# Altium project pulseox-main-PCB.PrjPcb
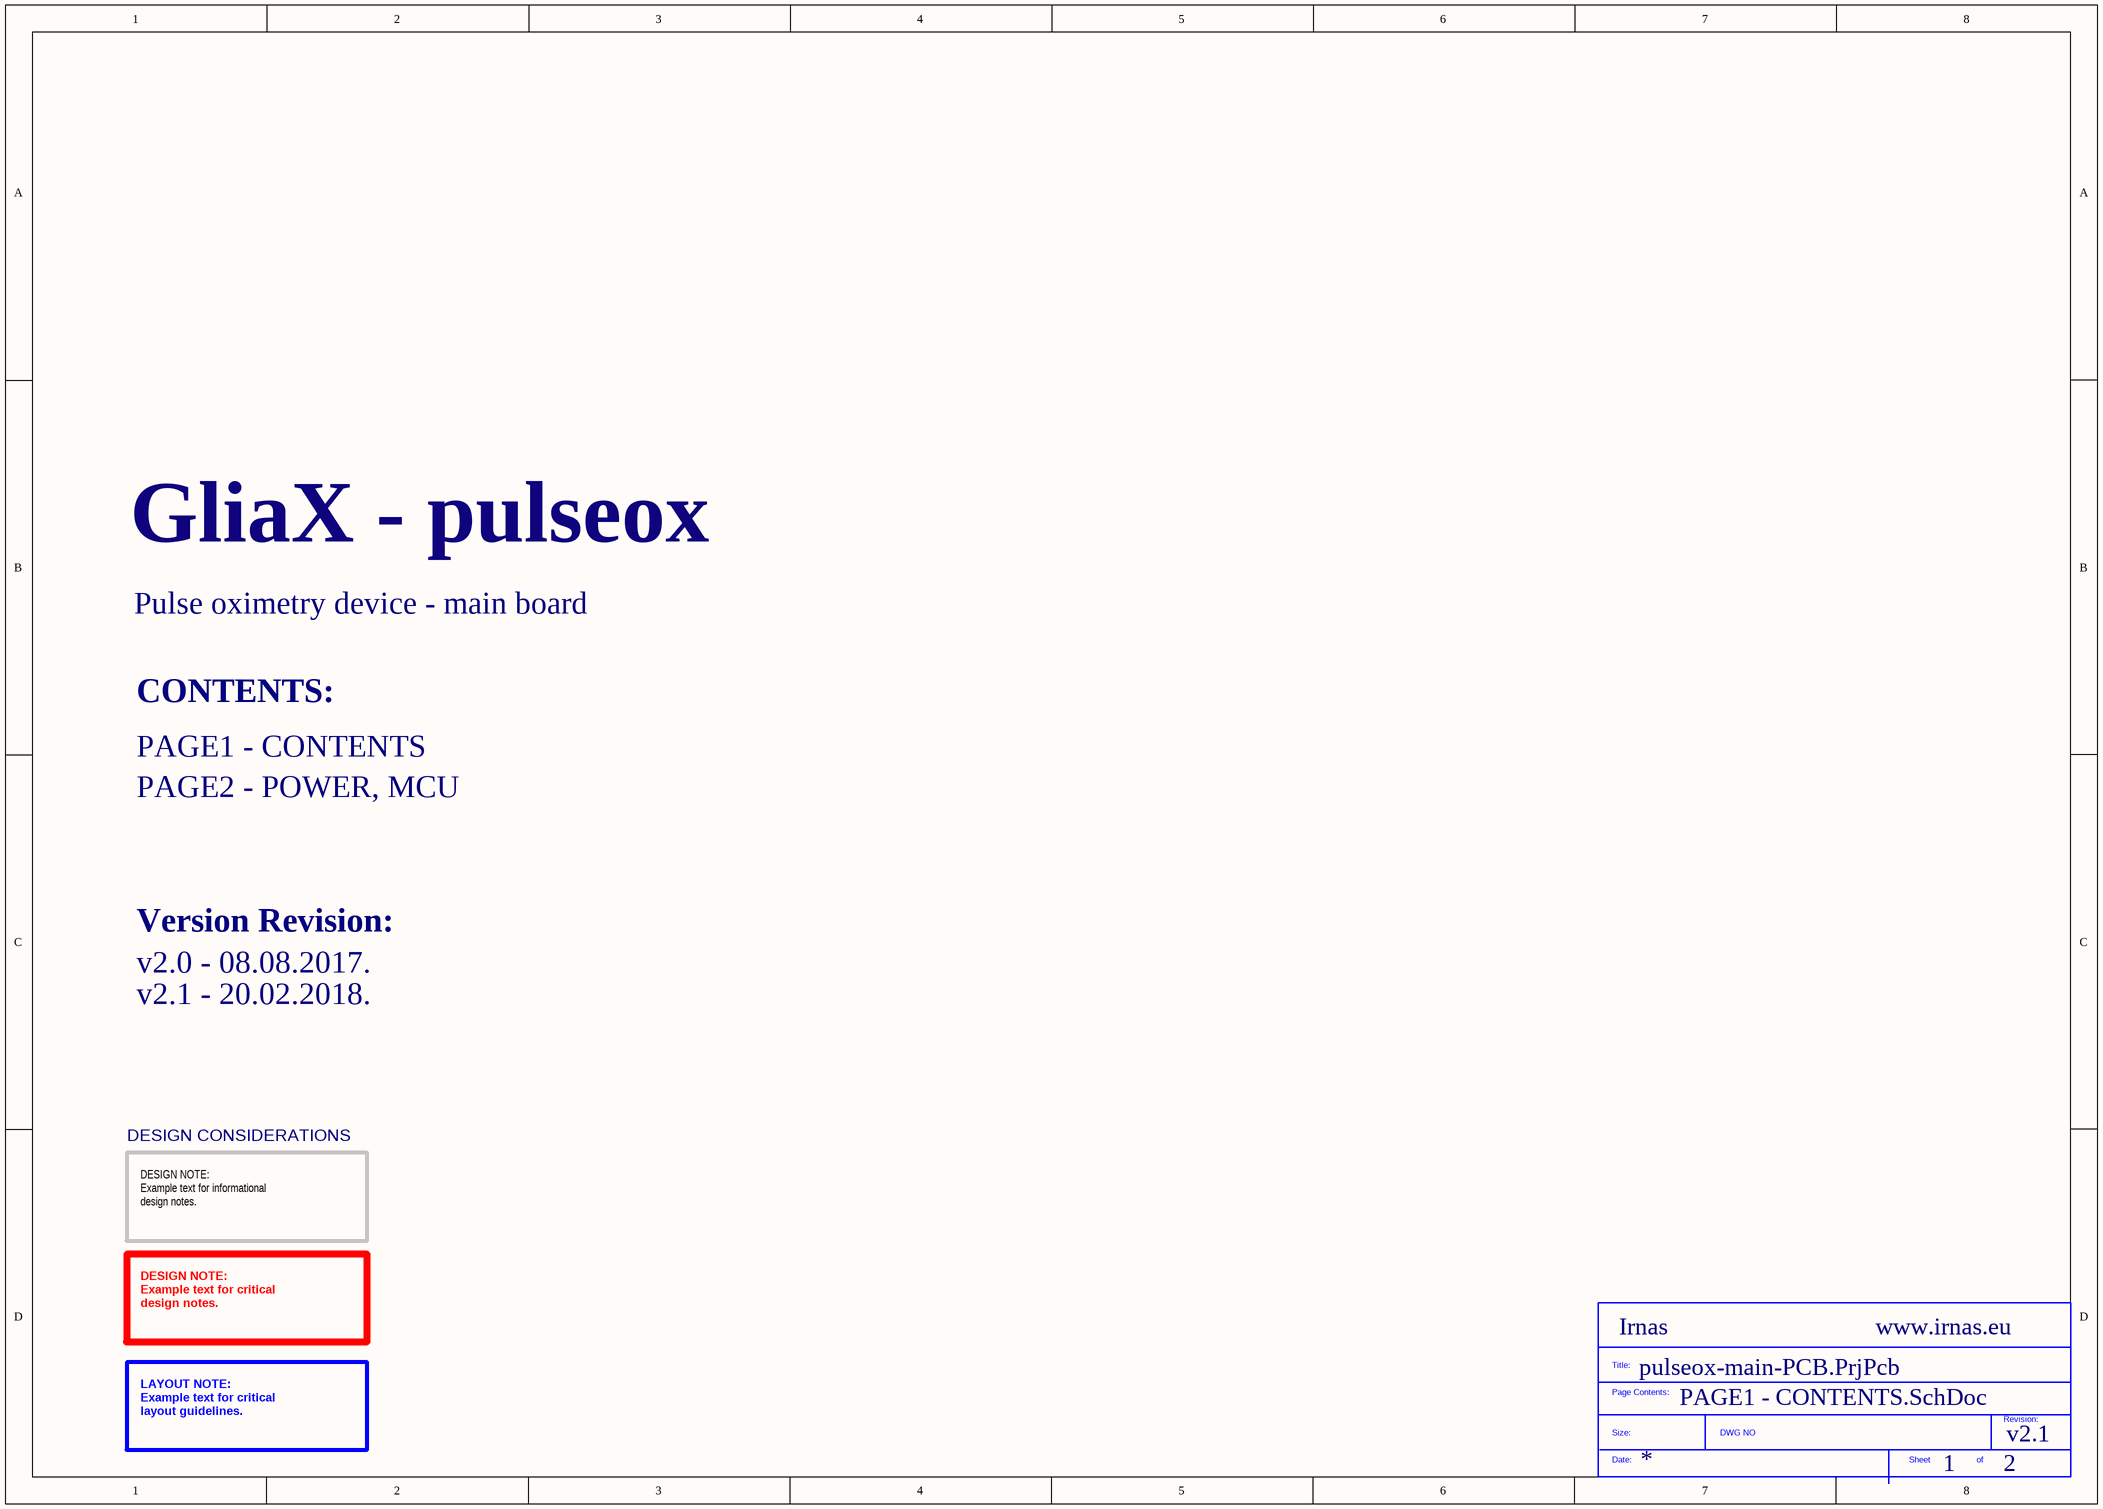
[diagram p0: PAGE1 - CONTENTS.SchDoc]
Company: Irnas; ProjectTitle: GliaX - pulseox; Version: v2.1; Website: www.irnas.eu
2 sheets, 32 parts. Net scope: global (net labels, ports and power ports of the same name join across sheets).
Board file: pulseox-main-PCB.PcbDoc
Sheets:
  PAGE1 - CONTENTS.SchDoc
  PAGE2 - POWER, MCU.SchDoc

## Sheet PAGE1 - CONTENTS.SchDoc
size A3; DocumentNumber: 1; SheetNumber: 1; SheetTotal: 2

### Parts
(Parts that share a designator on the sheet are numbered #1, #2 ... from top to bottom, then left to right.)
*?#1  SDTitleBlock  (value not drawn)  (graphical)

### Notes on the sheet
- Pulse oximetry device - main board
- CONTENTS:
- PAGE1 - CONTENTS
- PAGE2 - POWER, MCU
- Version Revision:
- v2.0 - 08.08.2017.
- v2.1 - 20.02.2018.
- DESIGN CONSIDERATIONS
- DESIGN NOTE:
  Example text for informational
  design notes.
- DESIGN NOTE:
  Example text for critical
  design notes.
- LAYOUT NOTE:
  Example text for critical
  layout guidelines.
- (in symbol SDTitleBlock) Title:; Page Contents:; Revision:; Size:; DWG NO; Date:; Sheet; of

## Sheet PAGE2 - POWER, MCU.SchDoc
size A3
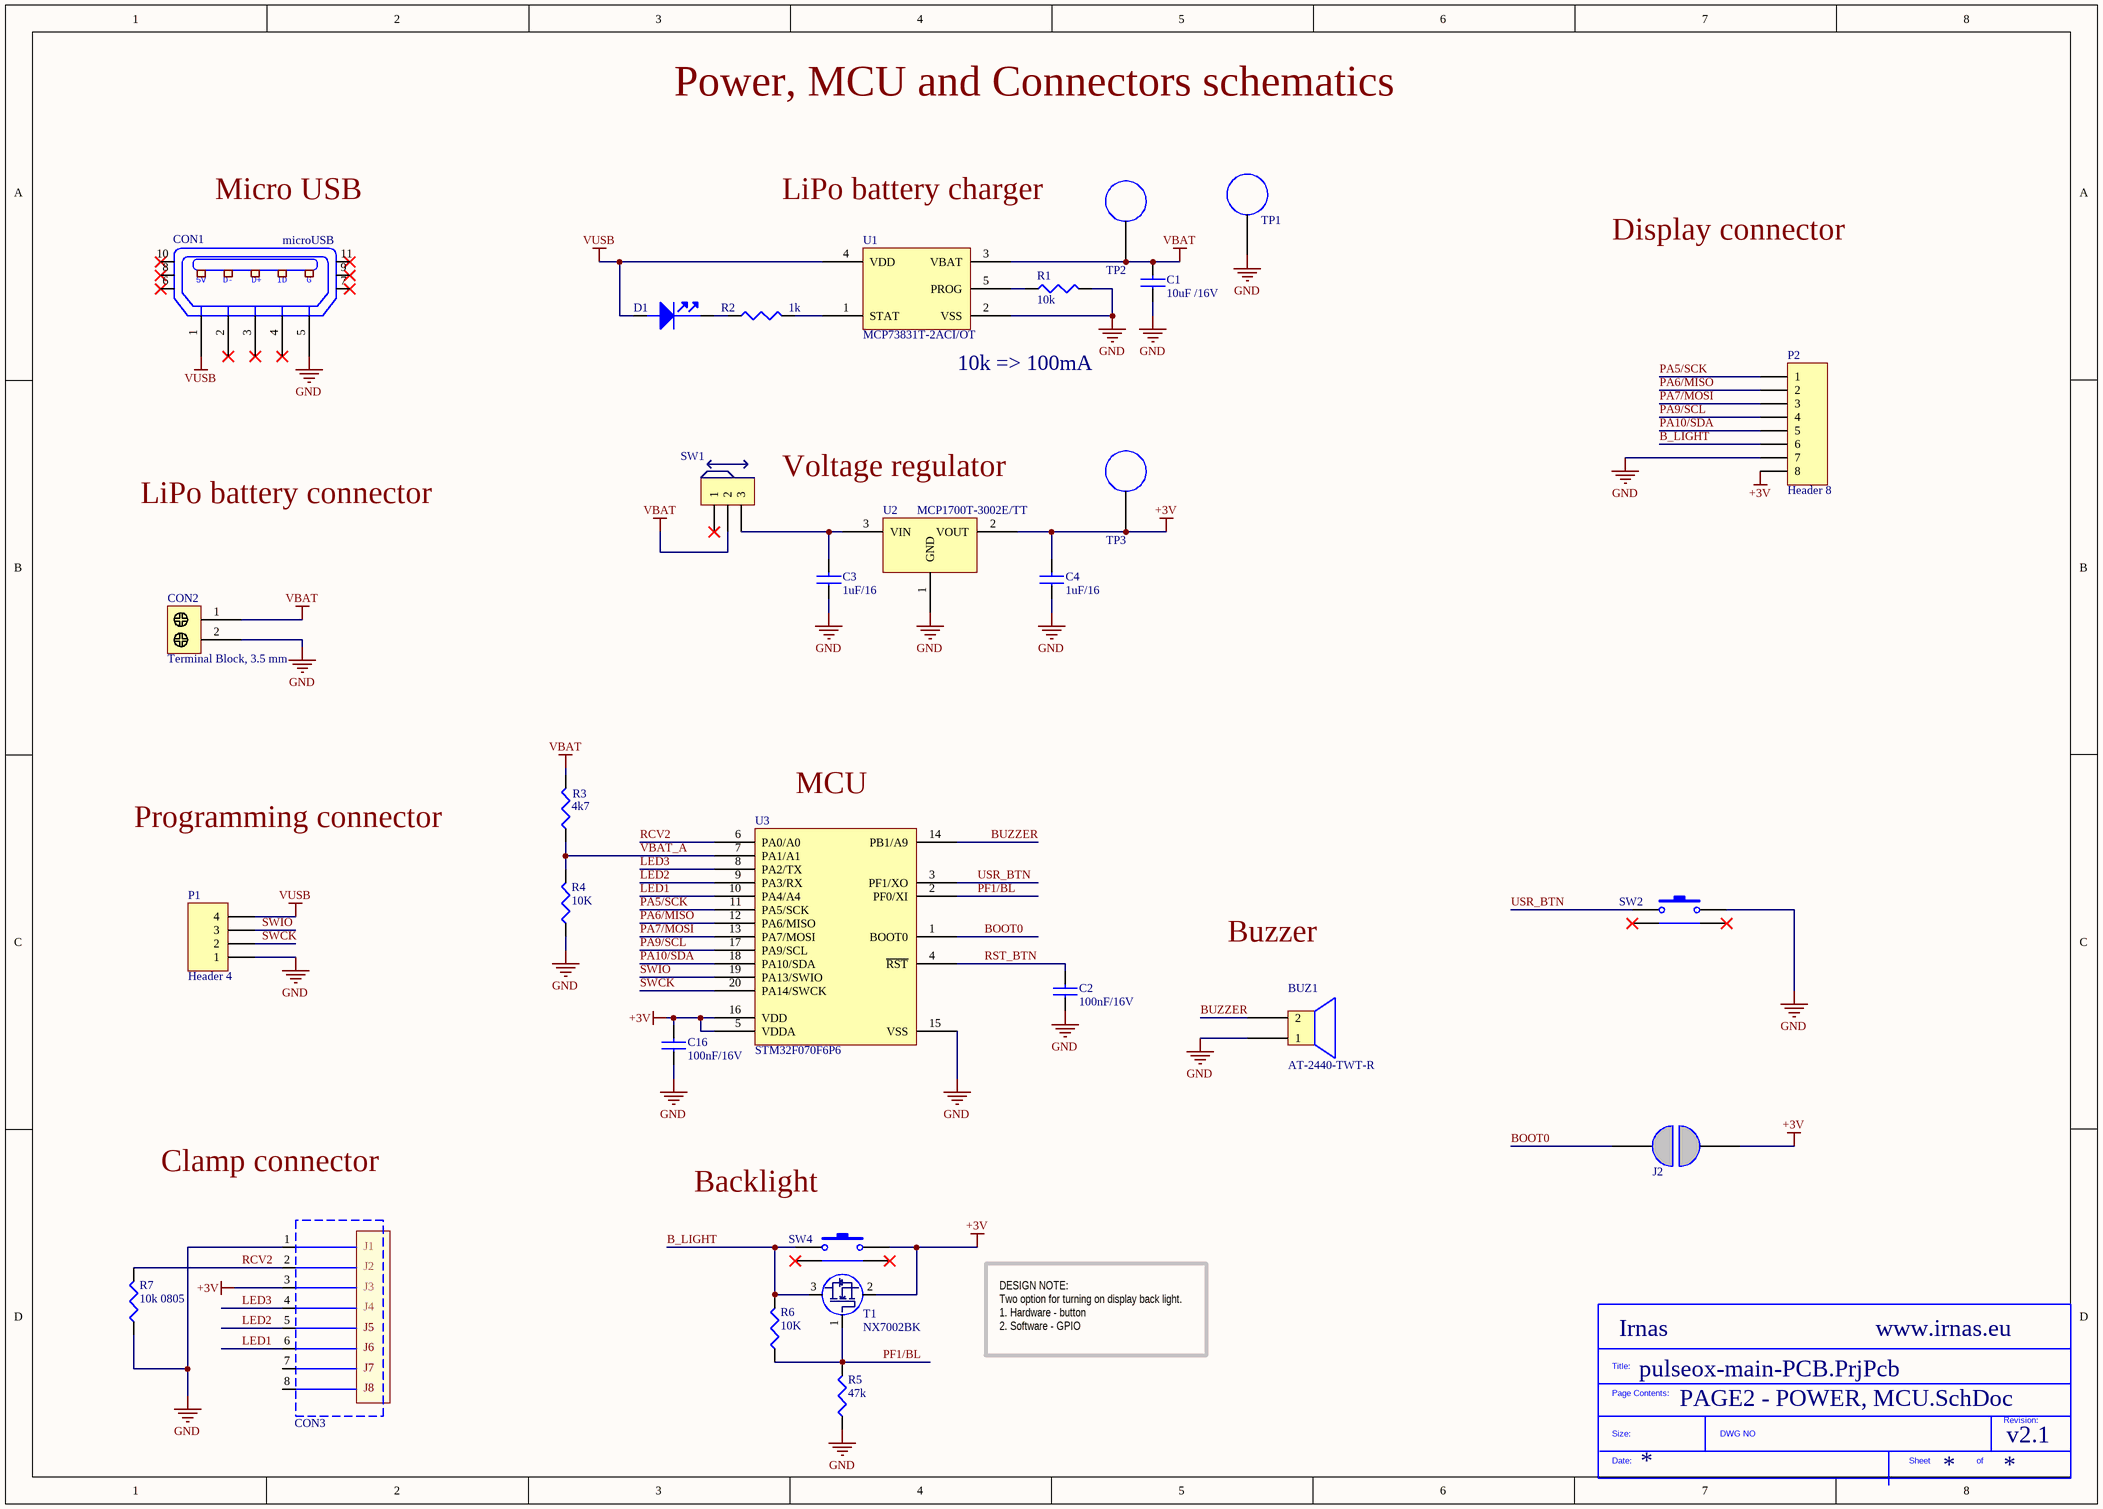
[diagram p1: PAGE2 - POWER, MCU.SchDoc]

### Parts
(Parts that share a designator on the sheet are numbered #1, #2 ... from top to bottom, then left to right.)
*?#2  SDTitleBlock  (value not drawn)  (graphical)
BUZ1  AT-2440-TWT-R  [Buzzer]
C1  10uF /16V  [CAP0805]
C2  100nF/16V  [CAP0805]
C3  1uF/16  [CAP0805]
C4  1uF/16  [CAP0805]
C16  100nF/16V  [CAP0805]
CON1  microUSB  [microUSB-CHINA]
CON2  Terminal Block, 3.5 mm  [Block Terminal 3.5mm]
CON3  PS000036  [eth con]  (value not drawn)
D1  LED RED  [LED0603]  (value not drawn)
J2  Solder jumper  [solder jumper smd]  (value not drawn)  (no BOM)
P1  Header 4  [HDR1X4]
P2  Header 8  [HDR1X8]
R1  10k  [RES0603]
R2  1k  [RES0603]
R3  4k7  [RES0805]
R4  10K  [RES0805]
R5  47k  [RES0805]
R6  10K  [RES0805]
R7  10k 0805  [RES0805]
SW1  SLIDE SW  [SLIDE_SW]  (value not drawn)
SW2  PTS645VH58-2LFS  [SW TH ANGLE_2]  (value not drawn)
SW4  FSMRA4JH04  [SW TH ANGLE_1]  (value not drawn)
T1  NX7002BK  [SOT23]
TP1  TP  [TP]  (value not drawn)  (no BOM)
TP2  TP  [TP]  (value not drawn)  (no BOM)
TP3  TP  [TP]  (value not drawn)  (no BOM)
U1  MCP73831T-2ACI/OT  [SOT23127P600-8N]
U2  MCP1700T-3002E/TT  [SOT23127P600-8N - duplicate]
U3  STM32F070F6P6  [SOP127P600-8N]

### Nets
+3V: C4.2 C16.2 CON3.3 J2.2 P2.8 SW4.2 T1.2(S) TP3.1 U2.2(VOUT) U3.5(VDDA) U3.16(VDD)
GND: BUZ1.1 C1.1 C2.1 C3.1 C4.1 C16.1 CON1.5(P5) CON2.2 CON3.1 P1.1 P2.7 R1.2 R4.1 R5.1 R7.1 SW2.2 TP1.1 U1.2(VSS) U2.1(GND) U3.15(VSS)
VBAT: C1.2 CON2.1 R3.2 SW1.2 TP2.1 U1.3(VBAT)
VUSB: CON1.1(P1) D1.2(ANODE) P1.4 U1.4(VDD)
B_LIGHT: P2.6 R6.2 SW4.1 T1.3(D)
BOOT0: J2.1 U3.1(BOOT0)
BUZZER: BUZ1.2 U3.14(PB1/A9)
LED1: CON3.6 U3.10(PA4/A4)
LED2: CON3.5 U3.9(PA3/RX)
LED3: CON3.4 U3.8(PA2/TX)
PA5/SCK: P2.1 U3.11(PA5/SCK)
PA6/MISO: P2.2 U3.12(PA6/MISO)
PA7/MOSI: P2.3 U3.13(PA7/MOSI)
PA9/SCL: P2.4 U3.17(PA9/SCL)
PA10/SDA: P2.5 U3.18(PA10/SDA)
PF1/BL: R5.2 R6.1 T1.1(G) U3.2(PF0/XI)
RCV2: CON3.2 R7.2 U3.6(PA0/A0)
RST_BTN: C2.2 U3.4(~{RST})
SWCK: P1.2 U3.20(PA14/SWCK)
SWIO: P1.3 U3.19(PA13/SWIO)
USR_BTN: SW2.1 U3.3(PF1/XO)
VBAT_A: R3.1 R4.2 U3.7(PA1/A1)
NetC3_2: C3.2 SW1.3 U2.3(VIN)
NetD1_1: D1.1(cathode) R2.1
NetR1_1: R1.1 U1.5(PROG)
NetR2_2: R2.2 U1.1(STAT)

Not connected (* = marked no-connect by the designer): CON1 2(P2)* 3(P3)* 4(P4)* 6* 7* 8* 9* 10* 11*; CON3 7 8; SW1 1*; SW2 3* 4*; SW4 3* 4*

### Notes on the sheet
- Power, MCU and Connectors schematics
- Micro USB
- (near TP2) LiPo battery charger
- Display connector
- (near U1) 10k => 100mA
- LiPo battery connector
- Voltage regulator
- Programming connector
- (near U3) MCU
- Buzzer
- Clamp connector
- (near SW4) Backlight
- DESIGN NOTE:
  Two option for turning on display back light.
  1. Hardware - button
  2. Software - GPIO
- (in symbol Micro USB CHINA 1) 5V; D-; D+; ID; G
- (in symbol PS000036) J1; J2; J3; J4; J5; J6; J7; J8
- (in symbol SDTitleBlock) Title:; Page Contents:; Revision:; Size:; DWG NO; Date:; Sheet; of

### Library data of the parts
BUZ1 = AT-2440-TWT-R: AUDIO PIEZO TRANSDUCER 1-30V TH; Manufacturer: PUI Audio, Inc.; Driver Circuitry: Transducer, Externally Driven; Input Type: Peak-Peak Signal; Voltage - Rated: 3V; Voltage Range: 1 ~ 30V; Frequency: 4kHz; Operating Mode: Single Tone; Sound Pressure Level (SPL): 80dB @ 3V, 10cm; Current - Supply: 1mA; Port Location: Top; Ratings: Washable; Supplier 1: Digi-Key; Manufacturer Part Number: AT-2440-TWT-R; RoHS: RoHS Compliant; Category: Audio Products; Stock 1: 3028; Pricing 1: 1=1.87, 10=1.7, 100=1.36, 500=1.1288, 1000=0.986, 5000=0.884 (USD); Packaging: Tray; Part Status: Active; Technology: Piezo; Duration: -; Operating Temperature: -20°C ~ 60°C; Approvals: -; Mounting Type: Through Hole; Termination: PC Pins; Size / Dimension: 0.945" Dia (24.00mm); Height - Seated (Max): 0.303" (7.70mm); ComponentLink1URL: http://www.puiaudio.com/pdf/AT-2440-TWT-R.pdf; ComponentLink1Description: http://www.puiaudio.com/pdf/AT-2440-TWT-R.pdf; Supplier Part Number 1: 668-1103-ND
C1 = 10uF /16V: TDK - CGA4J1X5R1C106K125AC - CAP, MLCC, X5R, 10UF, 16V, 0805; Supplier 1: Farnell; Manufacturer: TDK; Manufacturer Part Number: CGA4J1X5R1C106K125AC; RoHS: YES; Stock 1: 8974; Pricing 1: 5=0.41, 50=0.146, 250=0.131, 500=0.12, 1000=0.103 (GBP); ComponentLink1URL: http://bcove.me/e1v54mtm; ComponentLink1Description: http://bcove.me/e1v54mtm; ComponentLink2URL: http://www.farnell.com/datasheets/1936565.pdf; ComponentLink2Description: http://www.farnell.com/datasheets/1936565.pdf; ComponentLink3URL: http://www.farnell.com/datasheets/1683658.pdf; ComponentLink3Description: http://www.farnell.com/datasheets/1683658.pdf; Supplier Part Number 1: 2210948RL
C2 C16 = 100nF 16V 0805: MURATA - GRM219R71C104KA01D - CAP, MLCC, X7R, 0.1UF, 16V, 0805; Ceramic Capacitor Case: 0805 [2012 Metric]; Capacitance: 0.1; Voltage Rating: 16; Capacitance Tolerance: ± 10%; Dielectric Characteristic: X7; Product Range: GRM Series; SVHC: No SVHC (17-Dec-2015; Supplier 1: Farnell; Manufacturer: MURATA; Manufacturer Part Number: GRM219R71C104KA01D; RoHS: YES; Stock 1: 4286; Pricing 1: 10=0.0517, 100=0.0335, 500=0.0221, 1000=0.02, 2000=0.0175, 4000=0.0134, 20000=0.0095, 40000=0.0081 (GBP); Packaging: Cut Tape; Operating Temperature Min: -55; Operating Temperature Max: 125; Automotive Qualification Standard: -; MSL: MSL 1 - Unlimited; ComponentLink1URL: http://www.farnell.com/datasheets/2079178.pdf; ComponentLink1Description: http://www.farnell.com/datasheets/2079178.pdf; ComponentLink2URL: http://www.farnell.com/datasheets/1935878.pdf; ComponentLink2Description: http://www.farnell.com/datasheets/1935878.pdf; Supplier Part Number 1: 2611934
C3 C4 = 1uF 16V 0805: MURATA - GRM21BR71C105KA01K - CAP, MLCC, X7R, 1UF, 16V, 0805; Ceramic Capacitor Case: 0805 [2012 Metric]; Capacitance: 1; Voltage Rating: 16; Capacitance Tolerance: ± 10%; Dielectric Characteristic: X7; Product Range: GRM Series; SVHC: No SVHC (20-Jun-2016; Supplier 1: Farnell; Manufacturer: MURATA; Manufacturer Part Number: GRM21BR71C105KA01K; RoHS: YES; Stock 1: 18829; Pricing 1: 10=0.0623, 100=0.0388, 500=0.0279, 2500=0.0221, 5000=0.0195, 10000=0.0162, 50000=0.0139, 100000=0.0126 (GBP); Packaging: Cut Tape; Operating Temperature Min: -55; Operating Temperature Max: 125; Automotive Qualification Standard: -; MSL: MSL 1 - Unlimited; ComponentLink1URL: http://www.farnell.com/datasheets/2189141.pdf; ComponentLink1Description: http://www.farnell.com/datasheets/2189141.pdf; Supplier Part Number 1: 2688536
CON1 = Micro USB CHINA 1
CON2 = 1776275-2: TE CONNECTIVITY - 1776275-2 - TERMINAL BLOCK, WIRE TO BRD, 2POS, 18AWG; Pitch Spacing: 3.5; No. of Positions: 2; Wire Size AWG Min: 26; Wire Size AWG Max: 18; Conductor Area CSA: 0.9; Wire Connection Method: Screw; Rated Current: 7; Rated Voltage: 250; Block Orientation: Through Hole Right Angle; SVHC: No SVHC (15-Jun-2015); Approval Bodies: CSA, UL; Connector Mounting: PCB Mount; Connector Type: Terminal Block, PCB; Contact Current Rating: 10; Wire Area Size Max: 2.08mm²<!--FANDB--><div class="features-and-benefits-container"><div class="features-and-benefits-description"><span class="features-benefits-value">The 1776275-2 from TE Connectivity is a through hole, 2 position vertical PCB mount terminal block with interlocking. This terminal block comes with 3.5mm pitch spacing and is suitable for wire size ranging from 26AWG to 18; Supplier 1: Farnell; Manufacturer: TE CONNECTIVITY; Manufacturer Part Number: 1776275-2; RoHS: Y-EX; Stock 1: 22978; Pricing 1: 1=0.198, 50=0.148, 150=0.141, 250=0.135, 500=0.128, 1500=0.123 (GBP); Product Range: -; Colour: Blue; Contact Material: Brass; Contact Plating: Tin Plated Contacts; Lead Spacing: 3.5; Voltage Rating VAC: 250; ComponentLink1URL: http://www.farnell.com/datasheets/1899918.pdf; ComponentLink1Description: http://www.farnell.com/datasheets/1899918.pdf; ComponentLink2URL: http://www.farnell.com/cad/2291290.pdf; ComponentLink2Description: http://www.farnell.com/cad/2291290.pdf; ComponentLink3URL: http://www.farnell.com/datasheets/1650926.pdf; ComponentLink3Description: http://www.farnell.com/datasheets/1650926.pdf; ComponentLink4URL: http://www.farnell.com/datasheets/2159487.pdf; ComponentLink4Description: http://www.farnell.com/datasheets/2159487.pdf; Supplier Part Number 1: 1098611
CON3 = PS000036: Manufacturer: Pro Signal; Supplier 1: Farnell; Manufacturer Part Number: PS000036; Stock 1: 0; Supplier Part Number 1: 2787075
D1 = LED RED: BROADCOM LIMITED - HSMS-C190 - LED, RED, 10MCD, 626NM; LED Mounting: SMD; Forward Current If: 20; Forward Voltage: 2.1; Wavelength Typ: 626; Luminous Intensity: 10; Viewing Angle: 170°; Lens Shape: Rectangular; SVHC: No SVHC (17-Dec-2015)<!--FANDB--><div class="features-and-benefits-container"><div class="features-and-benefits-description"><span class="features-benefits-value">The HSMS-C190 is a HER SMD Chip LED with untinted/diffused lens, made of GaP. It is designed in an industry standard package 1.6 x 0.8mm footprint with 0.8mm profile. It is compatible with IR reflow solder processes. The small size and wide viewing angle make this LED prime choices for backlighting applications and front panel illumination especially where space is a premium.</span></div><div class="features-and-benefits-list"><ul class="features-and-benefits-list-list"><li class="features-and-benefits-list-item">Small size</li><li class="features-and-benefits-list-item">Industry standard footprint</li><li class="features-and-benefits-list-item">Compatible with IR solder</li><li class="features-and-benefits-list-item">Diffused optics</li><li class="features-and-benefits-list-item">-40 to 85; Supplier 1: Farnell; Manufacturer: BROADCOM LIMITED; Manufacturer Part Number: HSMS-C190; RoHS: YES; Stock 1: 7534; Pricing 1: 1=0.361, 10=0.256, 50=0.235, 100=0.106, 200=0.101 (GBP); LED Colour: Red; Bulb Size: -; Packaging: Cut Tape; Product Range: -; Automotive Qualification Standard: -; MSL: -; ComponentLink1URL: http://www.farnell.com/datasheets/313031.pdf; ComponentLink1Description: http://www.farnell.com/datasheets/313031.pdf; ComponentLink2URL: http://www.farnell.com/datasheets/1681524.pdf; ComponentLink2Description: http://www.farnell.com/datasheets/1681524.pdf; ComponentLink3URL: http://www.farnell.com/datasheets/2165483.pdf; ComponentLink3Description: http://www.farnell.com/datasheets/2165483.pdf; Supplier Part Number 1: 2497356
P1 = Header 4: Header, 4-Pin; LatestRevisionDate: 17-Jul-2002; LatestRevisionNote: Re-released for DXP Platform.; Publisher: Altium Limited
P2 = Header 8: Header, 8-Pin; LatestRevisionDate: 17-Jul-2002; LatestRevisionNote: Re-released for DXP Platform.; Publisher: Altium Limited
R1 = 10k: MULTICOMP - MCMR06X103 JTL - RES, CERAMIC, 10K, 5%, 0.1W, 0603; Resistance: 10; Voltage Rating: 75; Resistor Case Style: 0603 [1608 Metric]; Power Rating: 100; Product Range: MCMR Series; Temperature Coefficient: ± 100; Automotive Qualification Standard: -<!--FANDB--><div class="features-and-benefits-container"><div class="features-and-benefits-description"><span class="features-benefits-value">The Multicomp MCMR series resistors are automotive grade, anti sulphured thick film chip resistor. The resistance range includes E24 and E96 decade values from 1ohm to 10Mohm. These resistors are constructed on top of a high grade ceramic body.</span></div><div class="features-and-benefits-list"><ul class="features-and-benefits-list-list"><li class="features-and-benefits-list-item">EIA 0402, 0603, 0805, 1206 chip sizes available</li><li class="features-and-benefits-list-item">High reliability and stability</li><li class="features-and-benefits-list-item">Automotive grade AEC-Q200 compliant</li><li class="features-and-benefits-list-item">Complaint with (IEC 60068-1) 55/155/56 climatic category</li><li class="features-and-benefits-list-item">Maximum operation voltage of 50V, 75V, 150V and 200V</li><li class="features-and-benefits-list-item">Power rating of 62.5mW, 100mW, 125mW and 250mW</li><li class="features-and-benefits-list-item">Available in ±1% and ±5% tolerance</li><li class="features-and-benefits-list-item">Temperature coefficient (TCR) of +200ppm/°C, +100ppm/°C and -200ppm/°C to +400ppm/°C</li><li class="features-and-benefits-list-item">Operating temperature range -55°C to 155; Supplier 1: Farnell; Manufacturer: MULTICOMP; Manufacturer Part Number: MCMR06X103 JTL; RoHS: Y-EX; Stock 1: 19791; Pricing 1: 10=0.0087, 100=0.0074, 500=0.0061, 1000=0.0048, 2500=0.0032, 5000=0.0024, 25000=0.0016, 50000=0.0013 (GBP); Resistance Tolerance: ± 5%; Packaging: Cut Tape; Resistor Element Material: Ceramic; ComponentLink1URL: http://www.farnell.com/datasheets/1716707.pdf; ComponentLink1Description: http://www.farnell.com/datasheets/1716707.pdf; Supplier Part Number 1: 2073356
R2 = 1k: MULTICOMP - MCMR06X102 JTL - RES, CERAMIC, 1K, 5%, 0.1W, 0603; Resistance: 1; Voltage Rating: 75; Resistor Case Style: 0603 [1608 Metric]; Power Rating: 100; Product Range: MCMR Series; Temperature Coefficient: ± 100; Resistor Mounting: Surface Mount Device<!--FANDB--><div class="features-and-benefits-container"><div class="features-and-benefits-description"><span class="features-benefits-value">The Multicomp MCMR series resistors are automotive grade, anti sulphured thick film chip resistor. The resistance range includes E24 and E96 decade values from 1ohm to 10Mohm. These resistors are constructed on top of a high grade ceramic body.</span></div><div class="features-and-benefits-list"><ul class="features-and-benefits-list-list"><li class="features-and-benefits-list-item">EIA 0402, 0603, 0805, 1206 chip sizes available</li><li class="features-and-benefits-list-item">High reliability and stability</li><li class="features-and-benefits-list-item">Automotive grade AEC-Q200 compliant</li><li class="features-and-benefits-list-item">Complaint with (IEC 60068-1) 55/155/56 climatic category</li><li class="features-and-benefits-list-item">Maximum operation voltage of 50V, 75V, 150V and 200V</li><li class="features-and-benefits-list-item">Power rating of 62.5mW, 100mW, 125mW and 250mW</li><li class="features-and-benefits-list-item">Available in ±1% and ±5% tolerance</li><li class="features-and-benefits-list-item">Temperature coefficient (TCR) of +200ppm/°C, +100ppm/°C and -200ppm/°C to +400ppm/°C</li><li class="features-and-benefits-list-item">Operating temperature range -55°C to 155; Supplier 1: Farnell; Manufacturer: MULTICOMP; Manufacturer Part Number: MCMR06X102 JTL; RoHS: Y-EX; Stock 1: 18133; Pricing 1: 10=0.0089, 100=0.0076, 500=0.0063, 1000=0.0049, 2500=0.0033, 5000=0.0024, 25000=0.0016, 50000=0.0013 (GBP); Resistance Tolerance: ± 5%; Packaging: Cut Tape; Resistor Element Material: Ceramic; Automotive Qualification Standard: -; ComponentLink1URL: http://www.farnell.com/datasheets/1716707.pdf; ComponentLink1Description: http://www.farnell.com/datasheets/1716707.pdf; Supplier Part Number 1: 2073354
R3 = 4k7 1% 0805: VISHAY - CRCW08054K70FKEA - RES, THICK FILM, 4K7, 1%, 0.125W, 0805; Resistance: 4.7; Voltage Rating: 150; Resistor Case Style: 0805 [2012 Metric]; Power Rating: 125; Product Range: CRCW Series; Temperature Coefficient: ± 100; Automotive Qualification Standard: AEC-Q200; Resistor Mounting: Surface Mount Device<!--FANDB--><div class="features-and-benefits-container"><div class="features-and-benefits-description"><span class="features-benefits-value">The Vishay D/CRCW e3 series are standard thick film chip resistors. The resistance range includes E96 and E24 decade values from 1ohm to 10Mohm. CRCW e3 series resistors have a pure tin solder contacts on the Ni barrier layer that provides compatibility with reflow soldering process.</span></div><div class="features-and-benefits-list"><ul class="features-and-benefits-list-list"><li class="features-and-benefits-list-item">Automotive grade AEC-Q200 qualified</li><li class="features-and-benefits-list-item">EIA 0402, 0603, 0805, 1206, 1210, 1218, 2010, 2512 standard case sizes available</li><li class="features-and-benefits-list-item">Stability &Delta; Supplier 1: Farnell; Manufacturer: VISHAY; Manufacturer Part Number: CRCW08054K70FKEA; RoHS: Y-EX; Stock 1: 3035; Pricing 1: 10=0.0557, 100=0.0223, 500=0.0187, 1000=0.0086, 2500=0.0064 (GBP); Resistance Tolerance: ± 1%; Packaging: Cut Tape; Resistor Element Material: Thick Film; MSL: MSL 1 - Unlimited; ComponentLink1URL: http://www.vishay.com/docs/20014/smdpack.pdf; ComponentLink1Description: http://www.vishay.com/docs/20014/smdpack.pdf; ComponentLink2URL: http://www.farnell.com/datasheets/2310790.pdf; ComponentLink2Description: http://www.farnell.com/datasheets/2310790.pdf; ComponentLink3URL: http://www.farnell.com/cad/1552998.zip; ComponentLink3Description: http://www.farnell.com/cad/1552998.zip; Supplier Part Number 1: 1469923
R4 R6 = 10K 1% 0805_1: WALSIN - WR08X1002FTL - RES, THICK FILM, 10K, 1%, 150V, 0805; Resistance: 10; Voltage Rating: 150; Resistor Case Style: 0805 [2012 Metric]; Power Rating: 125; Product Range: WR08 Series; Temperature Coefficient: ± 100; Supplier 1: Farnell; Manufacturer: WALSIN; Manufacturer Part Number: WR08X1002FTL; RoHS: YES; Stock 1: 45511; Pricing 1: 10=0.0208, 100=0.0069, 500=0.0042, 1000=0.003, 2500=0.0023 (GBP); Resistance Tolerance: ± 1%; Packaging: Cut Tape; Resistor Element Material: Thick Film; Automotive Qualification Standard: -; MSL: MSL 2 - 1 year<!--FANDB--><div class="features-and-benefits-container"><div class="features-and-benefits-description"><span class="features-benefits-value">The WR08 series resistors from Walsin are thick film general purpose chip resistors. These resistors are constructed in a high grade ceramic body (aluminium oxide).</span></div><div class="features-and-benefits-list"><ul class="features-and-benefits-list-list"><li class="features-and-benefits-list-item">Resistance range includes E24 and E96 decade values from 1ohm to 10Mohm</li><li class="features-and-benefits-list-item">EIA 0805 case size</li><li class="features-and-benefits-list-item">Available in ?±100ppm/°C and -200ppm/°C to +400ppm/°C TCR values</li><li class="features-and-benefits-list-item">Available in ±1% and ±5% tolerance</li><li class="features-and-benefits-list-item">High reliability and stability</li><li class="features-and-benefits-list-item">Higher component and equipment reliability</li><li class="features-and-benefits-list-item">Lower assembly costs</li><li class="features-and-benefits-list-item">Continuous working voltage is 150V and rated power is 125; ComponentLink1URL: http://www.farnell.com/datasheets/1960319.pdf; ComponentLink1Description: http://www.farnell.com/datasheets/1960319.pdf; Supplier Part Number 1: 2502671
R5 = 47k 1% 0805: WELWYN - WCR0805-47KFI - RES, THICK FILM, 47K, 1%, 0.125W, 0805; Resistance: 47; Voltage Rating: 150; Resistor Case Style: 0805 [2012 Metric]; Power Rating: 125; Product Range: WCR Series; Temperature Coefficient: ± 100; Automotive Qualification Standard: AEC-Q200; SVHC: No SVHC (15-Jun-2015); External Depth: 0.55; External Length / Height: 2; External Width: 1.25; Insulation Resistance: 1000; Proof Voltage: 500; Reel Quantity: 5000; Resistor Mounting: Surface Mount Device; Supplier 1: Farnell; Manufacturer: WELWYN; Manufacturer Part Number: WCR0805-47KFI; RoHS: YES; Stock 1: 26620; Pricing 1: 10=0.0208, 100=0.0156, 500=0.0115, 1000=0.01, 2500=0.0088 (GBP); Resistance Tolerance: ± 1%; Packaging: Cut Tape; Resistor Element Material: Thick Film; No. of Pins: 2; Operating Temperature Max: 155; Operating Temperature Min: -55; Operating Temperature Range: -55°C to +155; Tape Width: 8; ComponentLink1URL: http://www.farnell.com/datasheets/2331353.pdf; ComponentLink1Description: http://www.farnell.com/datasheets/2331353.pdf; Supplier Part Number 1: 1099812
R7 = 10k 0805: MULTICOMP         MCWR08X1002FTL            Surface Mount Chip Resistor, Thick Film, MCWR Series, 10 kohm, 125 mW,  1%, 150 V; Resistance: 10kR; Power Rating: 125mW; Voltage Rating: 150V; Temperature Coefficient: 100ppm/°C; Supplier 1: Farnell; Manufacturer: Multicomp; Manufacturer Part Number: MCWR08X1002FTL; Stock 1: 2925000; Pricing 1: 5000=0.0013, 25000=0.0011 (EUR); Mount: Surface Mount; Case/Package: 0805; Case Code (Metric): 2012; Case Code (Imperial): 0805; Tolerance: 1%; Packaging: Cut Tape; Composition: Thick Film; Voltage Rating (DC): 150V; REACH SVHC: Unknown; ComponentLink1URL: https://datasheet.ciiva.com/46381/1849611-46381605.pdf; ComponentLink1Description: https://datasheet.ciiva.com/46381/1849611-46381605.pdf; Supplier Part Number 1: 2446870
SW1 = SLIDE SW: C & K COMPONENTS - OS102011MA1QS1 - SWITCH SLIDE SHORTING SPDT; Switch Operation: On-On; Switch Mounting: Through Hole; Contact Current Max: 100; Contact Voltage DC Max: 12; SVHC: No SVHC (20-Jun-2016)<!--FANDB--><div class="features-and-benefits-container"><div class="features-and-benefits-description"><span class="features-benefits-value">The OS102011MA1QS1 is a Miniature Slide Switch features a new high-temperature option for lead-free soldering. Designed with a variety of actuators and terminations, the miniature slide switches are ideal for thermostat applications, as well as test and measurement equipment, computer peripherals and consumer products.</span></div><div class="features-and-benefits-list"><ul class="features-and-benefits-list-list"><li class="features-and-benefits-list-item">SPDT Contact Configuration</li><li class="features-and-benefits-list-item">Variety of Actuators and Terminations</li><li class="features-and-benefits-list-item">PC and Panel Mounting</li><li class="features-and-benefits-list-item">Silver Contact Plating</li><li class="features-and-benefits-list-item">Shorting Contacts</li><li class="features-and-benefits-list-item">Halogen-free Material</li></ul></div><div class="features-and-benefits-applications"><ul class="features-and-benefits-value"><li class="features-and-benefits-list-item">Test & Measurement</li><li class="features-and-benefits-list-item">Computers & Computer Peripherals</li><li class="features-and-benefits-list-item">Communications & Networking</li><li class="features-and-benefits-list-item">Consumer Electronics</li></ul></div></div>; Supplier 1: Farnell; Manufacturer: C & K COMPONENTS; Manufacturer Part Number: OS102011MA1QS1; RoHS: YES; Stock 1: 1781; Pricing 1: 1=0.3, 75=0.251, 150=0.244, 250=0.2, 500=0.196, 1500=0.192, 2500=0.188, 5000=0.184 (GBP); Contact Configuration: SPDT; Product Range: -; Contact Voltage AC Max: -; Orientation: Right Angle; ComponentLink1URL: http://www.farnell.com/datasheets/1839844.pdf; ComponentLink1Description: http://www.farnell.com/datasheets/1839844.pdf; Supplier Part Number 1: 2435103
SW2 = PTS645VH58-2LFS: SWITCH TACTILE SPST-NO 0.05A 12V; Manufacturer: ITT C&K; Mechanical Life: 100000Cycles; Actuator Material: Nylon,Polyamide; Operating Force: 200gf; Throw Configuration: SPST; Max Current Rating: 50mA; Illumination Type: Non-Illuminated,Illuminated; Switch Function: Off-Mom; Supplier 1: Farnell; Manufacturer Part Number: PTS645VH58-2LFS; Stock 1: 7080; Pricing 1: 1=0.189, 10=0.175, 50=0.165, 100=0.141, 300=0.135, 700=0.107, 2000=0.105, 7000=0.103 (GBP); Mount: Through Hole; Contact Plating: Silver; Colour: Black; Contact Material: Brass,Silver; Min Operating Temperature: -20°C; Max Operating Temperature: 60°C; Package Quantity: 1000; Packaging: Bulk; Current Rating: 50mA; Voltage Rating (DC): 12V; Termination: PC Pins; Orientation: Right Angle; Length: 8.5mm; Depth: 9.8mm; REACH SVHC: No SVHC; Lead Free: Lead Free; ComponentLink1URL: https://datasheet.ciiva.com/29903/getdatasheetpartid-780336-29903805.pdf; ComponentLink1Description: https://datasheet.ciiva.com/29903/getdatasheetpartid-780336-29903805.pdf; ComponentLink2URL: https://datasheet.ciiva.com/22637/1707731-22637360.pdf; ComponentLink2Description: https://datasheet.ciiva.com/22637/1707731-22637360.pdf; Supplier Part Number 1: 2320088
SW4 = FSMRA4JH04: TE CONNECTIVITY         FSMRA4JH04             Tactile Switch, Non Illuminated, 1.57 N, 24 V, 50 mA, Solder, FSMRAJ Series; Mechanical Life: 100000Cycles; Voltage Rating (DC): 24V; Operating Force: 1.6N; Current Rating: 50mA; Throw Configuration: SPST; Actuator Length: 5.74mm; Supplier 1: Farnell; Manufacturer: TE Connectivity; Manufacturer Part Number: FSMRA4JH04; Stock 1: 19101; Pricing 1: 1=0.15, 500=0.142, 1000=0.117, 5000=0.115, 10000=0.112 (EUR); Mount: Through Hole,PCB; Contact Material: Copper Alloy; Min Operating Temperature: -35°C; Max Operating Temperature: 85°C; Package Quantity: 1000; Packaging: Bulk; Termination: Solder; Voltage Rating: 24V; Illumination Type: Illuminated; Contact Current Rating: 50mA; Length: 7.11mm; Width: 7.01mm; REACH SVHC: Unknown; ComponentLink1URL: https://datasheet.ciiva.com/5809/606398-5809313.pdf; ComponentLink1Description: https://datasheet.ciiva.com/5809/606398-5809313.pdf; ComponentLink2URL: https://datasheet.ciiva.com/7635/606398-7635446.pdf; ComponentLink2Description: https://datasheet.ciiva.com/7635/606398-7635446.pdf; Supplier Part Number 1: 1813692
T1 = NX7002BK: NEXPERIA - NX7002BK - MOSFET, N-CH, 60V, 0.27A, SOT-23-3; Transistor Polarity: N Channel; Continuous Drain Current Id: 270; Drain Source Voltage Vds: 60; On Resistance Rds(on): 2.2; Rds(on) Test Voltage Vgs: 10; Threshold Voltage Vgs: 1.6; Power Dissipation Pd: 310; Transistor Case Style: SOT-23; No. of Pins: 3; SVHC: No SVHC (17-Dec-2015; Supplier 1: Farnell; Manufacturer: NEXPERIA; Manufacturer Part Number: NX7002BK; RoHS: YES; Stock 1: 2195; Pricing 1: 1=0.0468, 25=0.0379, 100=0.0268, 250=0.0233, 500=0.0212, 1000=0.0189 (GBP); Operating Temperature Max: 150; Product Range: -; Automotive Qualification Standard: -; MSL: MSL 1 - Unlimited; ComponentLink1URL: http://www.farnell.com/datasheets/1970559.pdf; ComponentLink1Description: http://www.farnell.com/datasheets/1970559.pdf; Supplier Part Number 1: 2469640
U1 = MCP73831T-2ACI/OT: MICROCHIP - MCP73831T-2ACI/OT - LI-ION/LI-POLY CHARGE CONTROLLER; Supplier 1: Farnell; Manufacturer: MICROCHIP; Manufacturer Part Number: MCP73831T-2ACI/OT; RoHS: YES; Stock 1: 39052; Pricing 1: 1=0.476, 10=0.407, 25=0.385, 50=0.361, 100=0.336 (GBP); ComponentLink1URL: http://www.farnell.com/datasheets/2124927.pdf; ComponentLink1Description: http://www.farnell.com/datasheets/2124927.pdf; ComponentLink2URL: http://www.farnell.com/cad/1545964.zip; ComponentLink2Description: http://www.farnell.com/cad/1545964.zip; Supplier Part Number 1: 1332158
U2 = MCP1700T-3002E/TT: MICROCHIP - MCP1700T-3002E/TT - IC, LDO REGULATOR, 0.25A, 6V, SOT23-3; Supplier 1: Farnell; Manufacturer: MICROCHIP; Manufacturer Part Number: MCP1700T-3002E/TT; RoHS: YES; Stock 1: 35318; Pricing 1: 1=0.323, 10=0.296, 25=0.272, 50=0.247, 100=0.224 (GBP); ComponentLink1URL: http://www.farnell.com/datasheets/1784514.pdf; ComponentLink1Description: http://www.farnell.com/datasheets/1784514.pdf; ComponentLink2URL: http://www.farnell.com/cad/1545350.zip; ComponentLink2Description: http://www.farnell.com/cad/1545350.zip; ComponentLink3URL: http://www.farnell.com/datasheets/2289014.pdf; ComponentLink3Description: http://www.farnell.com/datasheets/2289014.pdf; Supplier Part Number 1: 1331482
U3 = STM32F070F6P6: STMICROELECTRONICS         STM32F070F6P6             32 Bit Microcontroller, Value Line, ARM Cortex-M0, 48 MHz, 32 KB, 6 KB, 20 Pins, TSSOP; Frequency: 48MHz; RAM Size: 6KB; Number of I/Os: 15; Min Supply Voltage: 2.4V; Max Supply Voltage: 3.6V; Memory Size: 32KB; Interface: I2C,SPI,USB,USART; Memory Type: FLASH; Watchdog Timer: Yes; Max Power Dissipation: 263mW; Data Bus Width: 32b; Number of Timers/Counters: 5; Supplier 1: Farnell; Manufacturer: STMicroelectronics; Manufacturer Part Number: STM32F070F6P6; Stock 1: 6108; Pricing 1: 1=2.11, 25=1.78, 50=1.74, 100=1.35, 250=1.31, 500=1.13, 1000=0.878, 2500=0.786 (EUR); Mount: Surface Mount; Case/Package: TSSOP; Number of Pins: 20; Contact Plating: Nickel,Gold; Min Operating Temperature: -40°C; Max Operating Temperature: 85°C; Max Frequency: 48MHz; Number of Programmable I/O: 15; Core Architecture: ARM; REACH SVHC: No SVHC; Lead Free: Lead Free; ComponentLink1URL: http://www.mouser.com/ds/2/389/stm32f070c6-956182.pdf; ComponentLink1Description: http://www.mouser.com/ds/2/389/stm32f070c6-956182.pdf; ComponentLink2URL: http://www.farnell.com/datasheets/1943789.pdf; ComponentLink2Description: http://www.farnell.com/datasheets/1943789.pdf; ComponentLink3URL: http://www.st.com/st-web-ui/static/active/en/resource/technical/document/datasheet/DM00141386.pdf; ComponentLink3Description: http://www.st.com/st-web-ui/static/active/en/resource/technical/document/datasheet/DM00141386.pdf; Supplier Part Number 1: 2488284